# EAGLE design DAPule-LPC11U35-v1.0.0 (EAGLE 7.7.0)

## Sheet 1 of 2
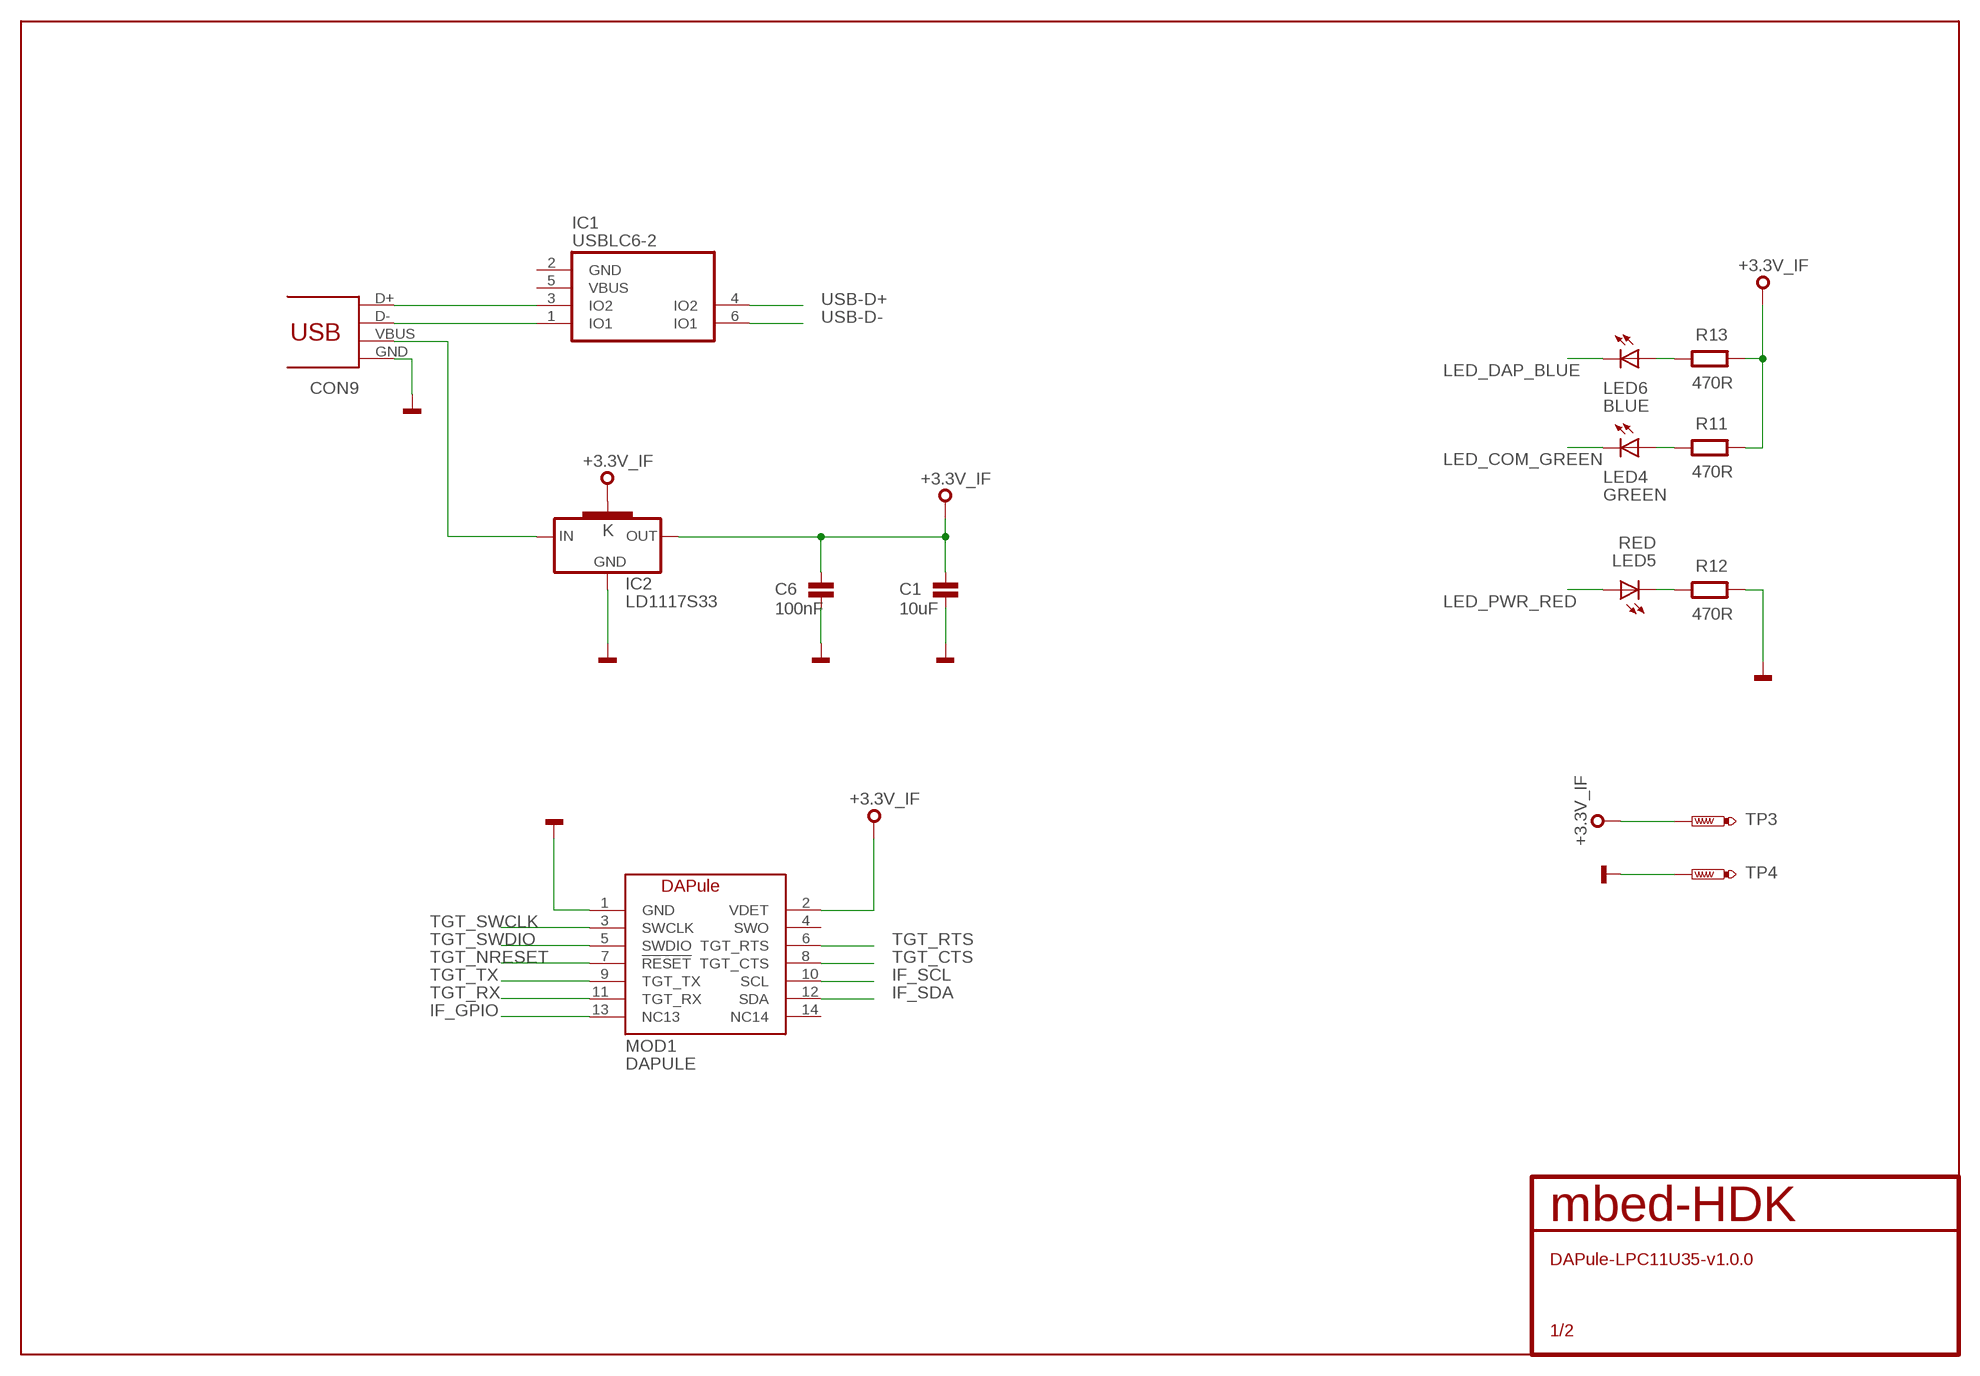
[diagram p0: schematic, sheet 1]

### Parts
C1  10uF  C0603  [0603]
C6  100nF  C0603  [0603]
CON9  USB_MICROB  [MOLEX-47364-0001]
IC1  USBLC6-2SC6  [SOT23-6L]
IC2  LD1117S33  [SOT223]
LED4  GREEN  LED0603  [CHIPLED_0603]
LED5  RED  LED0603  [CHIPLED_0603]
LED6  BLUE  LED0603  [CHIPLED_0603]
MOD1  DAPULE  [DAPULE]
R11  470R  R0603  [0603@1]
R12  470R  R0603  [0603@1]
R13  470R  R0603  [0603@1]
TP3  TEST-POINT-50R-PTH  [TP50-PTH]
TP4  TEST-POINT-50R-PTH  [TP50-PTH]

### Nets
+3.3V_IF: C1.1 C6.1 IC2.2(OUT) IC2.4(K) MOD1.2(VDET) R11.1 R13.1 TP3.TP ; also sheet 2
GND: C1.2 C6.2 CON9.GND IC2.1(GND) MOD1.1(GND) R12.1 TP4.TP ; also sheet 2
IF_GPIO: MOD1.13(NC13) ; also sheet 2
IF_SCL: MOD1.10(SCL) ; also sheet 2
IF_SDA: MOD1.12(SDA) ; also sheet 2
LED_COM_GREEN: LED4.C ; also sheet 2
LED_DAP_BLUE: LED6.C ; also sheet 2
LED_PWR_RED: LED5.A ; also sheet 2
N$2: LED4.A R11.2
N$3: CON9.D- IC1.1(IO1)
N$4: CON9.D+ IC1.3(IO2)
N$7: LED6.A R13.2
N$16: LED5.C R12.2
N$27: CON9.VBUS IC2.3(IN)
TGT_CTS: MOD1.8(TGT_CTS) ; also sheet 2
TGT_NRESET: MOD1.7(!RESET) ; also sheet 2
TGT_RTS: MOD1.6(TGT_RTS) ; also sheet 2
TGT_RX: MOD1.11(TGT_RX) ; also sheet 2
TGT_SWCLK: MOD1.3(SWCLK) ; also sheet 2
TGT_SWDIO: MOD1.5(SWDIO) ; also sheet 2
TGT_TX: MOD1.9(TGT_TX) ; also sheet 2
USB-D+: IC1.4(IO2) ; also sheet 2
USB-D-: IC1.6(IO1) ; also sheet 2
Unconnected: IC1.2(GND) IC1.5(VBUS) MOD1.4(SWO) MOD1.14(NC14)

## Sheet 2 of 2
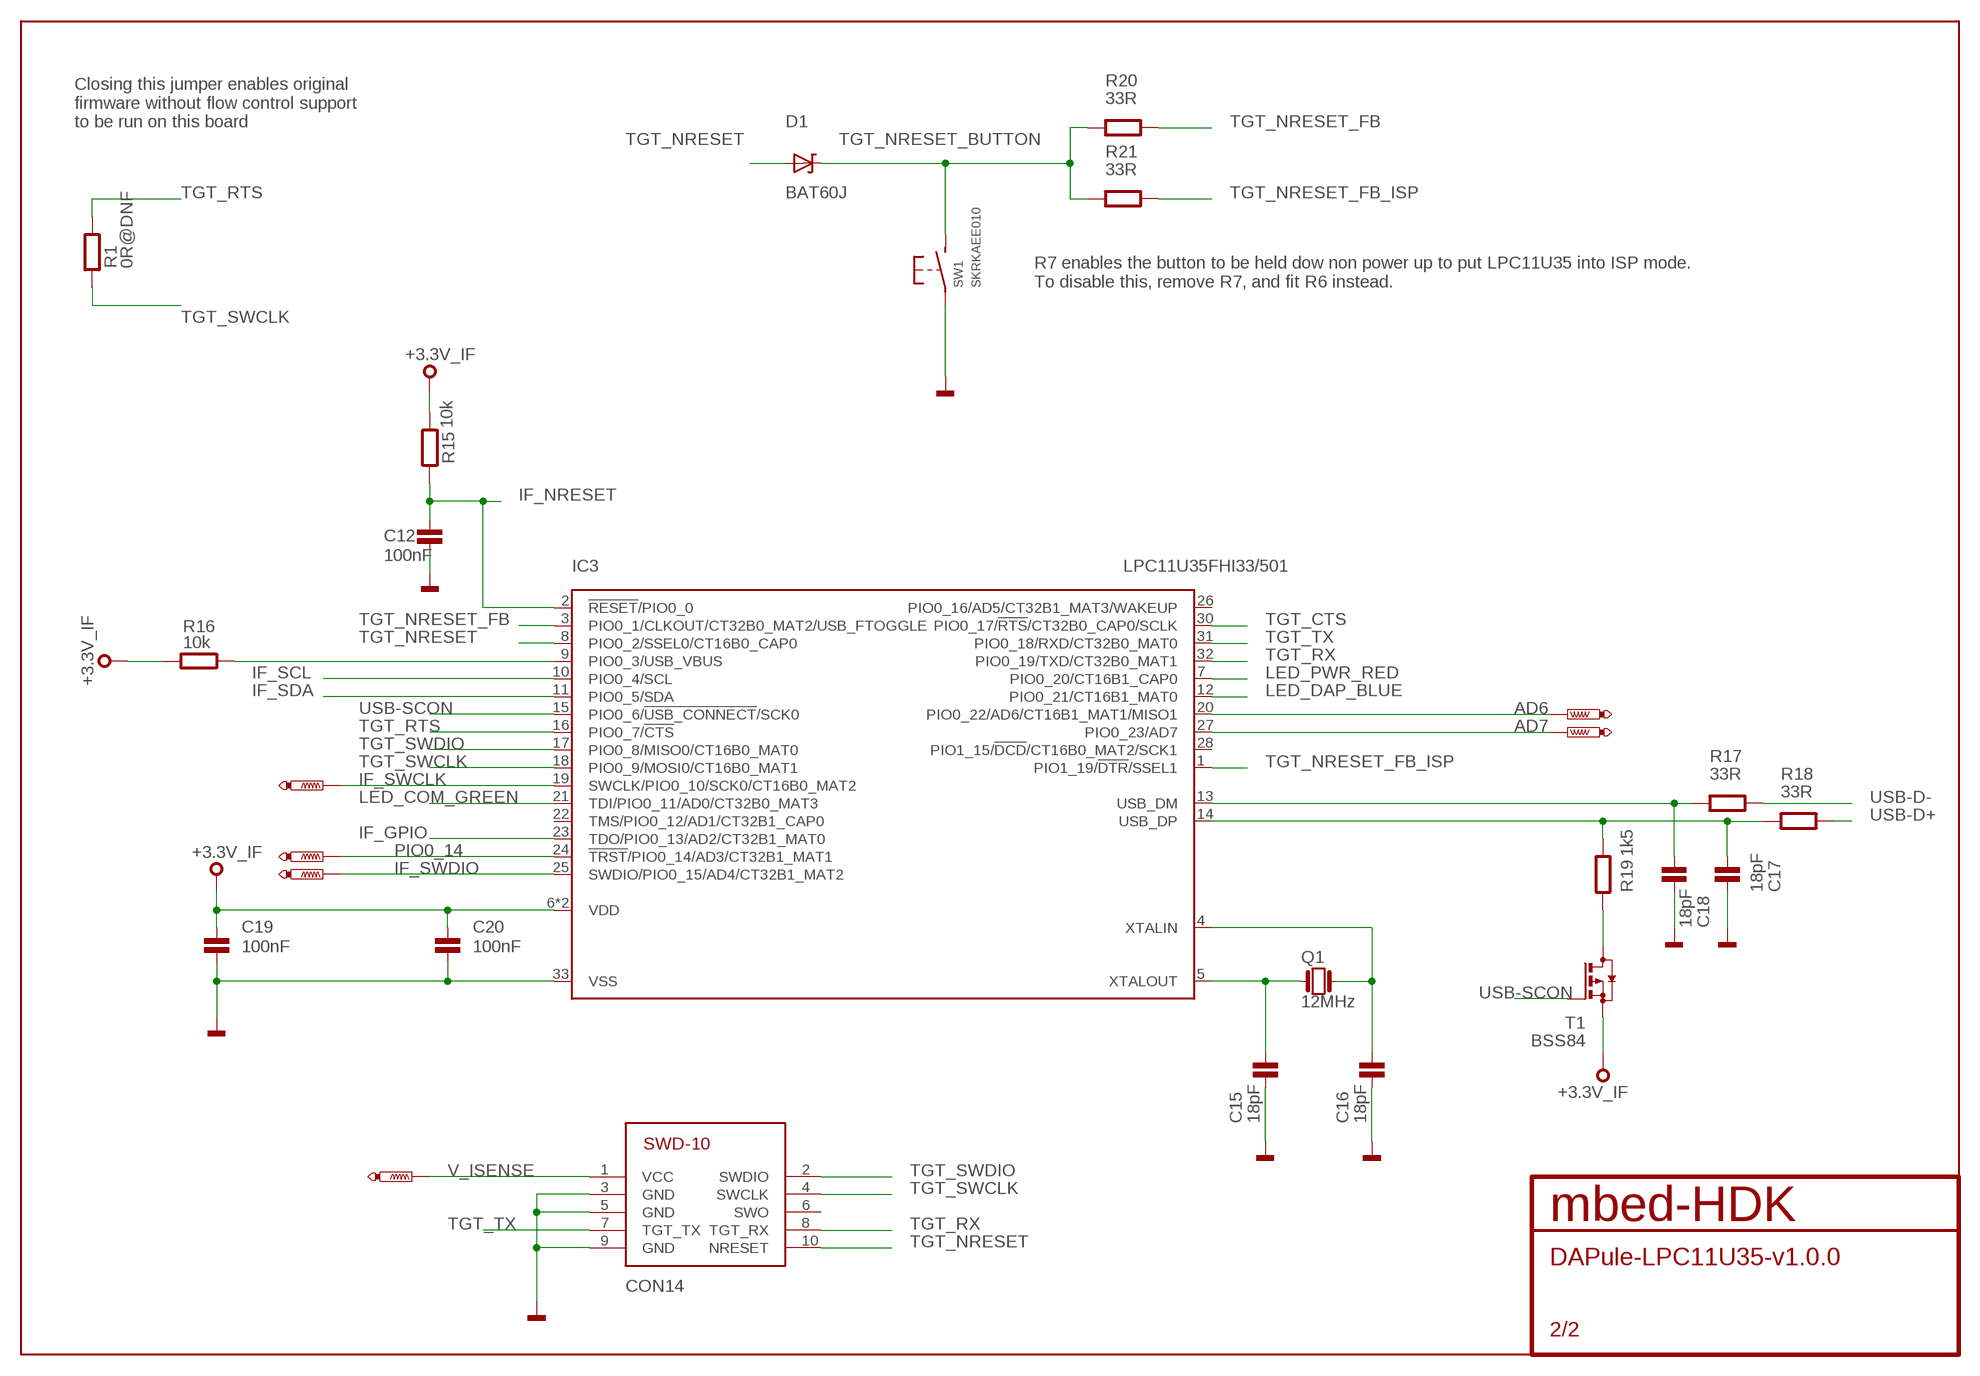
[diagram p1: schematic, sheet 2]

### Parts
C12  100nF  C0603  [0603]
C15  18pF  C0603  [0603]
C16  18pF  C0603  [0603]
C17  18pF  C0603  [0603]
C18  18pF  C0603  [0603]
C19  100nF  C0603  [0603]
C20  100nF  C0603  [0603]
CON14  SWD-10/TC2050_SMD  [FTSH-105-02]
D1  BAT60J  BAT60A  [BAT60A]
IC3  LPC11U35FHI33/501  [SOT617-3]
Q1  12MHz  Q_3.2X2.5  [3.2X.2.5]
R1  0R@DNF  R0402  [0402@1]
R15  10k  R0603  [0603@1]
R16  10k  R0603  [0603@1]
R17  33R  R0603  [0603@1]
R18  33R  R0603  [0603@1]
R19  1k5  R0603  [0603@1]
R20  33R  R0603  [0603@1]
R21  33R  R0603  [0603@1]
SW1  SKRKAEE010  [SKRKAEE010]
T1  BSS84  [SOT23]
TP1  PTR1TP16R  [TP16R]
TP8  PTR1TP07R  [TP07R]
TP9  PTR1TP07R  [TP07R]
TP11  PTR1TP07R  [TP07R]
TP12  PTR1TP07R  [TP07R]
TP13  PTR1TP07R  [TP07R]

### Nets
+3.3V_IF: C19.1 C20.1 IC3.6(VDD) IC3.29(VDD) R15.2 R16.2 T1.2(S) ; also sheet 1
AD6: IC3.20(PIO0_22/AD6/CT16B1_MAT1/MISO1) TP9.TP
AD7: IC3.27(PIO0_23/AD7) TP8.TP
GND: C12.2 C15.2 C16.2 C17.2 C18.2 C19.2 C20.2 CON14.3(GND) CON14.5(GND) CON14.9(GND) IC3.33(VSS) SW1.P$1(P) ; also sheet 1
IF_GPIO: IC3.23(TDO/PIO0_13/AD2/CT32B1_MAT0) ; also sheet 1
IF_NRESET: C12.1 IC3.2(!RESET!/PIO0_0) R15.1
IF_SCL: IC3.10(PIO0_4/SCL) ; also sheet 1
IF_SDA: IC3.11(PIO0_5/SDA) ; also sheet 1
IF_SWCLK: IC3.19(SWCLK/PIO0_10/SCK0/CT16B0_MAT2) TP12.TP
IF_SWDIO: IC3.25(SWDIO/PIO0_15/AD4/CT32B1_MAT2) TP11.TP
LED_COM_GREEN: IC3.21(TDI/PIO0_11/AD0/CT32B0_MAT3) ; also sheet 1
LED_DAP_BLUE: IC3.12(PIO0_21/CT16B1_MAT0) ; also sheet 1
LED_PWR_RED: IC3.7(PIO0_20/CT16B1_CAP0) ; also sheet 1
N$18: C15.1 IC3.5(XTALOUT) Q1.P$1
N$19: C16.1 IC3.4(XTALIN) Q1.P$3
N$20: IC3.9(PIO0_3/USB_VBUS) R16.1
N$23: R19.1 T1.3(D)
PIO0_14: IC3.24(!TRST!/PIO0_14/AD3/CT32B1_MAT1) TP13.TP
TGT_CTS: IC3.30(PIO0_17/!RTS!/CT32B0_CAP0/SCLK) ; also sheet 1
TGT_NRESET: CON14.10(NRESET) D1.A IC3.8(PIO0_2/SSEL0/CT16B0_CAP0) ; also sheet 1
TGT_NRESET_BUTTON: D1.K R20.2 R21.2 SW1.P$2(S)
TGT_NRESET_FB: IC3.3(PIO0_1/CLKOUT/CT32B0_MAT2/USB_FTOGGLE) R20.1
TGT_NRESET_FB_ISP: IC3.1(PIO1_19/!DTR!/SSEL1) R21.1
TGT_RTS: IC3.16(PIO0_7/!CTS!) R1.2 ; also sheet 1
TGT_RX: CON14.8(TGT_RX) IC3.32(PIO0_19/TXD/CT32B0_MAT1) ; also sheet 1
TGT_SWCLK: CON14.4(SWCLK) IC3.18(PIO0_9/MOSI0/CT16B0_MAT1) R1.1 ; also sheet 1
TGT_SWDIO: CON14.2(SWDIO) IC3.17(PIO0_8/MISO0/CT16B0_MAT0) ; also sheet 1
TGT_TX: CON14.7(TGT_TX) IC3.31(PIO0_18/RXD/CT32B0_MAT0) ; also sheet 1
USB-D+: R18.1 ; also sheet 1
USB-D-: R17.1 ; also sheet 1
USB-SCON: IC3.15(PIO0_6/!USB_CONNECT!/SCK0) T1.1(G)
USB_DM: C18.1 IC3.13(USB_DM) R17.2
USB_DP: C17.1 IC3.14(USB_DP) R18.2 R19.2
V_ISENSE: CON14.1(VCC) TP1.TP
Unconnected: CON14.6(SWO) IC3.22(TMS/PIO0_12/AD1/CT32B1_CAP0) IC3.26(PIO0_16/AD5/CT32B1_MAT3/WAKEUP) IC3.28(PIO1_15/!DCD!/CT16B0_MAT2/SCK1)

### Notes on the sheet
- Closing this jumper enables original
  firmware without flow control support
  to be run on this board
- R7 enables the button to be held dow non power up to put LPC11U35 into ISP mode.
  To disable this, remove R7, and fit R6 instead.

## Library data of the parts
C1 C6 C12 C15-C20 = mbed-HDK:C: Capacitor
CON9 = mbed-HDK:USB: USB Connectors
CON14 = mbed-HDK-Connector:SWD-10/TC2050: 1mm pitch 10-Pin Cortex Programming Header with optional TC2050 footprint solderless interchangeable
D1 = mbed-HDK:BAT60A: Schottky Diode
IC1 = mbed-HDK:USBLC6-2
IC2 = mbed-HDK:LD1117S33: VOLTAGE REGULATOR SMD 3,3V
IC3 = mbed-HDK:LPC11U35FHI33: 32-bit ARM Cortex-M0 microcontroller; up to 128 kB flash; up to 12 kB SRAM and 4 kB EEPROM; USB device; USART The LPC11U3x are a ARM Cortex-M0 based, low-cost 32-bit MCU family, designed for 8/16-bit microcontroller applications, offering performance, low power, simple instruction set and memory addressing together with reduced code size compared to existing 8/16-bit architectures. The LPC11U3x operate at CPU frequencies of up to 50 MHz. Equipped with a highly flexible and configurable Full Speed USB 2.0 device controller, the LPC11U3x brings unparalleled design flexibility and seamless integration to today’s demanding connectivity solutions. The peripheral complement of the LPC11U3x includes up to 128 kB of flash memory, up to 12 kB of SRAM data memory and 4 kB EEPROM, one Fast-mode Plus I 2 C-bus interface, one RS-485/EIA-485 USART with support for synchronous mode and smart card interface, two SSP interfaces, four general purpose counter/timers, a 10-bit ADC, and up to 54 general purpose I/O pins. AAL Eindhoven MK; FLASH: 64kB; GPIO: 26; SRAM: 12kB
LED4-LED6 = mbed-HDK:LED: SMD LED
MOD1 = blackbriar:DAPULE
Q1 = mbed-HDK:Q
R1 R11-R13 R15-R21 = mbed-HDK:R
SW1 = mbed-HDK-Switch:SKRKAEE010: MOMENTARY SWITCH PUSH VERTICAL (SPST); MF: ALPS; MFN: SKRKAEE010; OC-MOUSER: 688-SKRKAE
T1 = mbed-HDK:BSS84: P-CHANNEL MOS FET
TP1 TP8 TP9 TP11-TP13 = blackbriar:PTR1: TEST PIN
TP3 TP4 = mbed-HDK:TEST-POINT

## Board
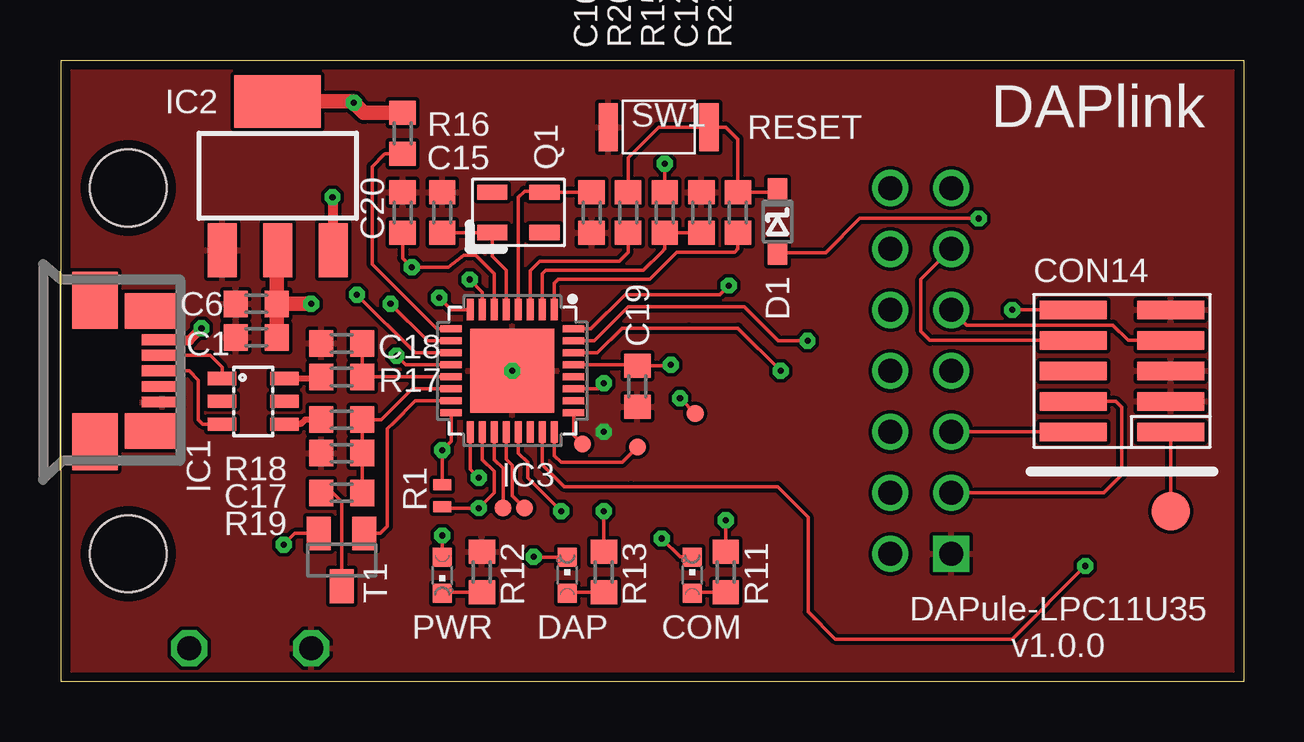
[diagram p2: board, top side]
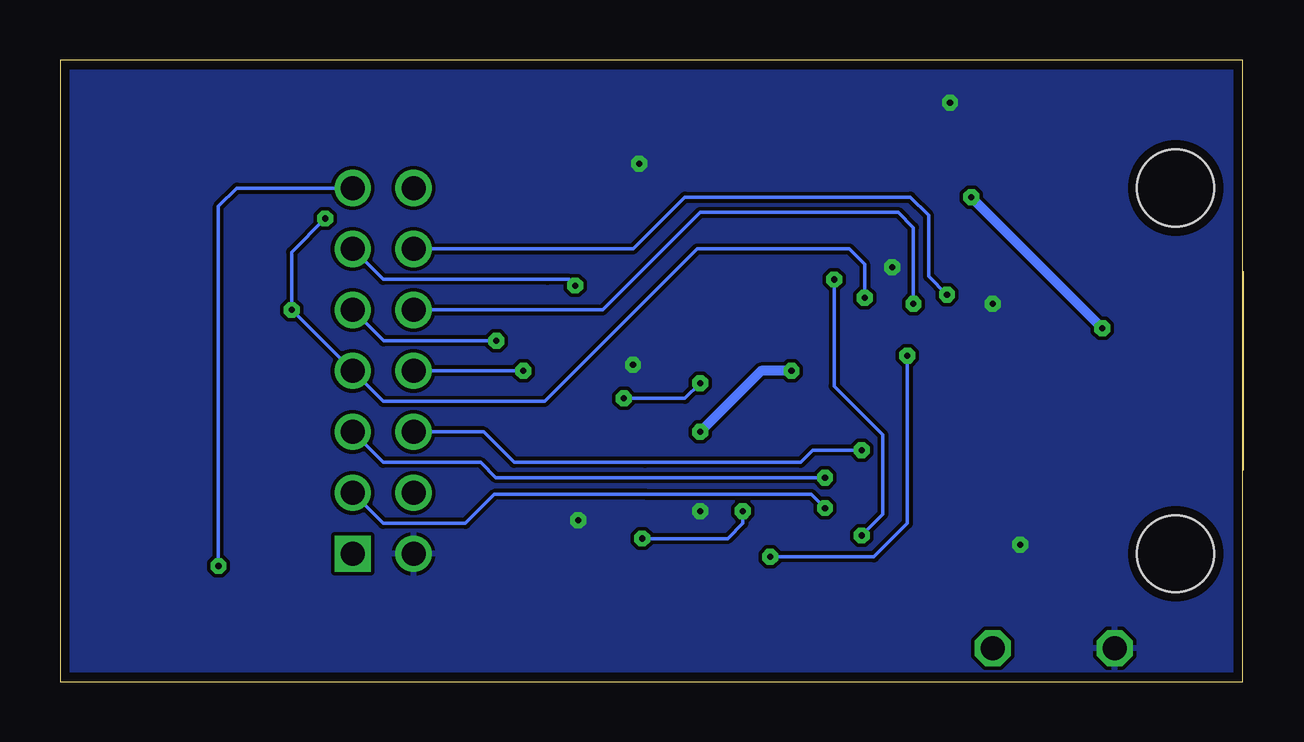
[diagram p3: board, bottom side, seen from below]

Size 49.33 x 25.91 mm. Coordinates in mm from the lower left corner, seen from the top.
Outline: 0.05,4.06 0.05,25.65 0.05,25.91 45.9,25.91 49.33,25.91 49.33,0 46.03,0 0.05,0 0.05,4.06
Copper layers ((1*16)): Top 0.035mm / dielectric 0.8mm / Bottom 0.035mm
Design rules "mbed-HDK-6-6-2-layer *": minimum track width 6mil, minimum drill 9mil, track to track 6mil, track to pad 6mil, pad to pad 6mil, via to via 6mil, smd to smd 6mil, copper to edge 15mil, drill to drill 8mil, minimum pad ring 10mil, minimum via ring 8mil, stop-mask expansion 4mil, vias tented up to drill 0mil, thermal gap 6mil

### Footprints (pad centres in the part's own frame; a part is rotated, then mirrored left to right if it is on the bottom)
0603 = smd 1 x 1.1: 1 -0.85,0; 2 0.85,0
MOLEX-47364-0001 = smd 1.7 x 0.45: 4 2.8,-0.65; D+ 2.8,0; D- 2.8,0.65; GND 2.8,-1.3; VBUS 2.8,1.3 | smd 1.9 x 2.375: GND1 0,2.95; GND4 0,-2.95 | smd 2.1 x 1.475: GND2 2.3,2.5; GND3 2.3,-2.5
FTSH-105-02 = smd 0.762 x 2.794: 1 0.381,-2.032; 2 0.381,2.032; 3 1.651,-2.032; 4 1.651,2.032; 5 2.921,-2.032; 6 2.921,2.032; 7 4.191,-2.032; 8 4.191,2.032; 9 5.461,-2.032; 10 5.461,2.032
BAT60A = smd 1 x 0.8: A 1.3,0; K -1.3,0
SOT23-6L = smd 0.55 x 1.2: 1 -0.95,-1.3; 2 0,-1.3; 3 0.95,-1.3; 4 0.95,1.3; 5 0,1.3; 6 -0.95,1.3
SOT223 = smd 1.219 x 2.235: 1 -2.311,-3.099; 2 0,-3.099; 3 2.311,-3.099 | smd 3.6 x 2.2: 4 0,3.099
SOT617-3 = smd 0.9 x 0.29: 1 -2.55,1.75; 2 -2.55,1.25; 3 -2.55,0.75; 4 -2.55,0.25; 5 -2.55,-0.25; 6 -2.55,-0.75; 7 -2.55,-1.25; 8 -2.55,-1.75; 17 2.55,-1.75; 18 2.55,-1.25; 19 2.55,-0.75; 20 2.55,-0.25; 21 2.55,0.25; 22 2.55,0.75; 23 2.55,1.25; 24 2.55,1.75 | smd 0.29 x 0.9: 9 -1.75,-2.55; 10 -1.25,-2.55; 11 -0.75,-2.55; 12 -0.25,-2.55; 13 0.25,-2.55; 14 0.75,-2.55; 15 1.25,-2.55; 16 1.75,-2.55; 25 1.75,2.55; 26 1.25,2.55; 27 0.75,2.55; 28 0.25,2.55; 29 -0.25,2.55; 30 -0.75,2.55; 31 -1.25,2.55; 32 -1.75,2.55 | smd 3.5 x 3.5: 33 0,0
CHIPLED_0603 = smd 0.8 x 0.8: A 0,-0.75; C 0,0.75
DAPULE = drill 1 square: 1 36.83,-7.62 | drill 1: 2 34.29,-7.62; 3 36.83,-5.08; 4 34.29,-5.08; 5 36.83,-2.54; 6 34.29,-2.54; 7 36.83,0; 8 34.29,0; 9 36.83,2.54; 10 34.29,2.54; 11 36.83,5.08; 12 34.29,5.08; 13 36.83,7.62; 14 34.29,7.62 | hole 3.2: 2.54,7.62; 2.54,-7.62
3.2X.2.5 = smd 1.27 x 0.635: P$1 -1.092,-0.838; P$2 1.092,-0.838; P$3 1.092,0.838; P$4 -1.092,0.838
0402@1 = smd 0.457 x 0.762: 1 -0.457,0; 2 0.457,0
0603@1 = smd 1 x 1.1: 1 -0.85,0; 2 0.85,0
SKRKAEE010 = smd 0.8 x 2: P$1 -2.1,0; P$2 2.1,0
SOT23 = smd 1 x 1.4: 1 -0.95,-1.1; 2 0.95,-1.1; 3 0,1.1
TP16R = smd 1.6 x 1.6: TP 0,0
TP50-PTH = drill 1 octagon: TP 0,0
TP07R = smd 0.7 x 0.7: TP 0,0

### Placement (x,y rotation side)
C1  8.18,14.35 180 top
C6  8.18,15.75 180 top
C12  26.72,19.56 90 top
C15  15.93,19.56 90 top
C16  22.15,19.56 270 top
C17  11.74,9.53 180 top
C18  11.74,14.1 180 top
C19  24.06,12.32 270 top
C20  14.28,19.56 90 top
CON9  1.45,12.95 0 top
CON14  44.25,10.03 90 top
D1  29.9,19.18 270 top
IC1  8.05,11.68 270 top
IC2  9.07,21.08 0 top
IC3  18.85,12.95 270 top
LED4  26.34,4.45 0 top
LED5  15.93,4.45 180 top
LED6  21.13,4.45 0 top
MOD1  0.31,12.95 0 top
Q1  19.1,19.56 0 top
R1  15.93,7.75 90 top
R11  27.74,4.57 270 top
R12  17.58,4.57 270 top
R13  22.66,4.57 270 top
R15  25.2,19.56 90 top
R16  14.28,22.86 90 top
R17  11.74,12.7 0 top
R18  11.74,10.92 0 top
R19  11.74,7.87 0 top
R20  23.67,19.56 90 top
R21  28.25,19.56 90 top
SW1  24.95,23.11 0 top
T1  11.74,5.08 180 top
TP1  46.28,7.11 0 top
TP3  5.39,1.4 90 top
TP4  10.47,1.4 90 top
TP8  26.47,11.18 90 top
TP9  19.36,7.24 90 top
TP11  21.77,9.91 90 top
TP12  18.47,7.24 90 top
TP13  24.06,9.78 90 top

### Tracks (layer width: path | path; a pad name or v marks a point on that pad's centre or on a via)
+3.3V_IF  (via drill 0.25, 0.25 pad 0.25)
  Top 0.152: R13.1 v22.66,7.11 | IC3.29 24.02,13.2 C19.1 25.41,13.17 v25.45,13.21 | R15.2 25.2,21.08 v25.2,21.59 | IC3.6 18.1,17.01 17.32,17.78 16.82,17.78 16.18,17.27 v14.66,17.27 14.28,17.65 C20.1 | R11.1 v27.74,6.73 | T1.2 9.79,6.18 v9.32,5.72
  Top 0.61: IC2.4 12.19,24.18 v12.25,24.13 12.67,23.71 R16.2 | C1.1 C6.1 | C6.1 v10.47,15.75 | C6.1 9.03,17.94 IC2.2
  pour Bottom: 0.31,0.25 49.33,0.25 49.33,25.65 0.31,25.65
AD6
  Top 0.152: IC3.20 18.6,9.27 18.85,9.02 18.85,7.74 TP9.TP
AD7  (via drill 0.25 pad 0.25)
  Top 0.152: 25.82,11.82 v25.83,11.81 TP8.TP | IC3.27 22.42,12.2 v22.66,12.45
  Bottom 0.152: v22.66,12.45 23.29,11.81 v25.83,11.81
GND  (via drill 0.25 pad 0.25)
  Bottom 0.406: IC3.33 20.12,12.95 v22.66,10.41
  other vias: 18.85,12.95
  pour Top: 0.31,0.25 49.33,0.25 49.33,25.65 0.31,25.65
IF_GPIO  (via drill 0.25)
  Top 0.152: IC3.23 20.1,9.04 21.01,8.13 23.8,8.13 29.9,8.13 31.17,6.86 31.17,2.92 32.31,1.78 39.68,1.78 v42.73,4.83
  Bottom 0.152: v42.73,4.83 42.73,19.81 41.96,20.57 MOD1.13
IF_NRESET
  Top 0.152: C12.1 R15.1 25.2,18.03 25.07,17.91 24.31,17.14 20.25,17.14 20.1,17 IC3.2
IF_SCL  (via drill 0.25)
  Top 0.152: IC3.10 15.31,14.2 v13.77,15.75
  Bottom 0.152: v13.77,15.75 13.77,18.92 14.4,19.56 22.66,19.56 26.72,15.49 28.25,15.49 29.52,15.49 MOD1.10
IF_SDA  (via drill 0.25)
  Top 0.152: IC3.11 14.8,13.7 v12.37,16.13
  Bottom 0.152: v12.37,16.13 13.13,16.89 13.13,19.43 13.9,20.19 23.29,20.19 25.45,18.03 MOD1.12
IF_SWCLK
  Top 0.152: IC3.19 18.1,9.26 18.47,8.89 TP12.TP
IF_SWDIO
  Top 0.152: TP11.TP 21.4,10.28 IC3.25
LED_COM_GREEN  (via drill 0.25 pad 0.25)
  Top 0.152: IC3.21 19.1,9.53 19.48,9.14 19.48,8.51 v20.88,7.11 | v25.07,5.97 25.83,5.21 26.33,5.21 LED4.C
  Bottom 0.152: v20.88,7.11 20.88,6.6 21.52,5.97 v25.07,5.97
LED_DAP_BLUE  (via drill 0.25, 0.25 pad 0.25)
  Top 0.152: v19.74,5.21 19.75,5.2 LED6.C | IC3.12 14.41,13.2 v14.02,13.59
  Bottom 0.152: v19.74,5.21 15.42,5.21 14.4,6.22 14.02,6.6 v14.02,13.59
LED_PWR_RED  (via drill 0.25 pad 0.25)
  Top 0.152: IC3.7 17.6,16.24 v17.07,16.76 | LED5.A v15.93,6.1
  Bottom 0.152: v17.07,16.76 17.07,12.32 15.04,10.29 15.04,6.99 v15.93,6.1
N$2
  Top 0.152: R11.2 26.37,3.72 LED4.A
N$3
  Top 0.152: CON9.D- 6.26,13.6 6.66,13.21 6.75,13.11 IC1.1
N$4
  Top 0.152: CON9.D+ 5.39,12.95 5.77,12.57 5.77,10.92 5.89,10.8 5.96,10.73 IC1.3
N$7
  Top 0.152: R13.2 21.16,3.72 LED6.A
N$16
  Top 0.152: 15.96,3.72 R12.2
  Top 0.406: LED5.C 15.96,3.72
N$18
  Top 0.152: IC3.5 18.6,17.14 18.01,17.73 Q1.P$1 15.94,18.72 C15.1
N$19
  Top 0.152: C16.1 20.21,20.41 Q1.P$3 20.14,20.45 19.36,20.45 19.1,20.19 IC3.4
N$20
  Top 0.152: IC3.9 15.7,14.7 15.42,14.99 15.04,15.37 13.9,16.51 13.01,17.4 13.01,21.46 13.52,21.97 13.55,22.01 R16.1
N$23
  Top 0.152: R19.1 11.36,7.87 11.74,7.49 T1.3
N$27  (via drill 0.25)
  Top 0.406: CON9.VBUS 4.53,14.22 5.39,14.22 v5.89,14.73 | v11.36,20.19 11.36,18.01 IC2.3
  Bottom 0.406: v5.89,14.73 v11.36,20.19
PIO0_14
  Top 0.152: IC3.24 20.6,9.43 20.88,9.14 23.42,9.14 TP13.TP
TGT_CTS  (via drill 0.25)
  Top 0.152: IC3.30 22.39,13.7 23.42,14.73 26.21,14.73 28.25,14.73 v30.02,12.95
  Bottom 0.152: v30.02,12.95 MOD1.8
TGT_NRESET  (via drill 0.25, 0.25 pad 0.25)
  Top 0.152: IC3.8 16.3,15.5 v15.8,16 | v39.68,15.49 CON14.10 | D1.A 31.9,17.88 33.33,19.3 v38.28,19.3
  Bottom 0.152: v15.8,16 15.8,17.4 16.44,18.03 18.47,18.03 22.79,18.03 29.14,11.68 30.15,11.68 32.06,11.68 35.87,11.68 MOD1.7 v39.68,15.49 39.68,17.91 v38.28,19.3
TGT_NRESET_BUTTON
  Top 0.152: R20.2 23.67,21.84 24.95,23.11 SW1.P$2 27.74,23.11 28.25,22.61 R21.2 29.83,20.41 D1.K
TGT_NRESET_FB
  Top 0.152: IC3.3 19.6,17.13 19.99,17.53 23.29,17.53 23.67,17.91 R20.1
TGT_NRESET_FB_ISP
  Top 0.152: IC3.1 20.6,16.61 20.75,16.76 24.56,16.76 25.33,17.53 25.71,17.91 28.12,17.91 28.25,18.03 R21.1
TGT_RTS  (via drill 0.25 pad 0.25)
  Top 0.152: IC3.16 16.3,10.02 v15.93,9.65 R1.2
  Bottom 0.152: v15.93,9.65 17.96,9.65 18.47,9.14 24.95,9.14 30.41,9.14 31.68,10.41 MOD1.6
TGT_RX  (via drill 0.25)
  Top 0.152: IC3.32 22.12,14.7 23.55,16.13 27.48,16.13 v27.87,16.51 | CON14.8 36.25,14.22 35.87,14.61 35.87,16.76 MOD1.11
  Bottom 0.152: v27.87,16.51 28.12,16.76 29.01,16.76 35.87,16.76 MOD1.11
TGT_SWCLK  (via drill 0.25 pad 0.25)
  Top 0.152: IC3.18 17.6,9.25 18.09,8.76 18.09,8 18.09,7.87 v17.45,7.24 15.98,7.24 R1.1 | MOD1.3 43.49,7.87 44.25,8.64 44.25,11.43 44,11.68 CON14.4
  Bottom 0.152: v17.45,7.24 18.02,7.81 24.88,7.81 31.23,7.81 32.44,6.6 35.87,6.6 MOD1.3
TGT_SWDIO  (via drill 0.25 pad 0.25)
  Top 0.152: v17.45,8.51 17.1,8.86 IC3.17 | MOD1.5 CON14.2
  Bottom 0.152: v17.45,8.51 24.95,8.51 31.17,8.51 31.8,9.14 35.87,9.14 MOD1.5
TGT_TX  (via drill 0.25)
  Top 0.152: IC3.31 22.26,14.2 23.67,15.62 28.5,15.62 29.92,14.2 v31.15,14.2 | MOD1.9 37.77,14.86 43.87,14.86 44.5,14.22 CON14.7
  Bottom 0.152: v31.15,14.2 35.85,14.2 MOD1.9
USB-D+
  Top 0.254: R18.1 10.21,10.92 10.09,10.8 10.03,10.73 IC1.4
USB-D-
  Top 0.254: R17.1 10.82,12.63 IC1.6
USB-SCON
  Top 0.152: T1.1 13.35,6.18 13.39,6.22 13.64,6.48 13.64,10.16 13.64,10.54 13.9,10.8 14.8,11.7 IC3.15
USB_DM
  Top 0.152: C18.1 R17.2 13.26,12.7 14.53,12.7 IC3.13
USB_DP
  Top 0.152: R19.2 C17.1 R18.2 13.39,10.92 14.67,12.2 IC3.14
V_ISENSE
  Top 0.152: TP1.TP CON14.1

### Text on the board
tPlace: RESET | DAPlink | DAPule-LPC11U35 / v1.0.0 | PWR | DAP | COM